# EAGLE design led555 (EAGLE 8.2.2)
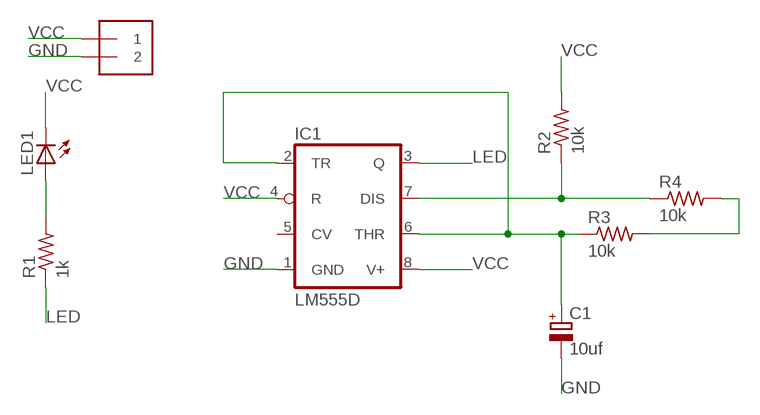
[diagram p0: schematic, sheet 1]

## Parts
C1  10uf  CPOL-EU140CLH-0810  [140CLH-0810]
IC1  LM555D  [SO08]
J1  power  1X2-3.5MM  [1X2-3.5MM]
LED1  LED5MM  [LED5MM]
R1  1k  R-US_M1206  [M1206]
R2  10k  R-US_M1206  [M1206]
R3  10k  R-US_M1206  [M1206]
R4  10k  R-US_M1206  [M1206]

## Nets
GND: C1.- IC1.1(GND) J1.2
LED: IC1.3(Q) R1.1
N$1: LED1.A R1.2
N$2: C1.+ IC1.2(TR) IC1.6(THR) R3.1
N$3: R3.2 R4.2
N$4: IC1.7(DIS) R2.1 R4.1
VCC: IC1.4(R) IC1.8(V+) J1.1 LED1.K(C) R2.2
Unconnected: IC1.5(CV)

## Library data of the parts
C1 = rcl:CPOL-EU: POLARIZED CAPACITOR, European symbol
IC1 = adafruit:*555: TIMER Changed DIP package to have round (not oval) pin pads http://www.ladyada.net/library/pcb/eaglelibrary.html
J1 = adafruit:1X2: 3.5mm Terminal block http://www.ladyada.net/library/pcb/eaglelibrary.html
LED1 = adafruit:LED: LED OSRAM: - CHIPLED LG R971, LG N971, LY N971, LG Q971, LY Q971, LO R971, LY R971 LH N974, LH R974 LS Q976, LO Q976, LY Q976 LO Q996 - Hyper CHIPLED LW Q18S LB Q993, LB Q99A, LB R99A - SideLED LS A670, LO A670, LY A670, LG A670, LP A670 LB A673, LV A673, LT A673, LW A673 LH A674 LY A675 LS A676, LA A676, LO A676, LY A676, LW A676 LS A679, LY A679, LG A679 - Hyper Micro SIDELED® LS Y876, LA Y876, LO Y876, LY Y876 LT Y87S - SmartLED LW L88C, LW L88S LB L89C, LB L89S, LG L890 LS L89K, LO L89K, LY L89K LS L896, LA L896, LO L896, LY L896 - TOPLED LS T670, LO T670, LY T670, LG T670, LP T670 LSG T670, LSP T670, LSY T670, LOP T670, LYG T670 LG T671, LOG T671, LSG T671 LB T673, LV T673, LT T673, LW T673 LH T674 LS T676, LA T676, LO T676, LY T676, LB T676, LH T676, LSB T676, LW T676 LB T67C, LV T67C, LT T67C, LS T67K, LO T67K, LY T67K, LW E67C LS E67B, LA E67B, LO E67B, LY E67B, LB E67C, LV E67C, LT E67C LW T67C LS T679, LY T679, LG T679 LS T770, LO T770, LY T770, LG T770, LP T770 LB T773, LV T773, LT T773, LW T773 LH T774 LS E675, LA E675, LY E675, LS T675 LS T776, LA T776, LO T776, LY T776, LB T776 LHGB T686 LT T68C, LB T68C - Hyper Mini TOPLED® LB M676 - Mini TOPLED Santana® LG M470 LS M47K, LO M47K, LY M47K Source: http://www.osram.convergy.de/
R1-R4 = adafruit:R-US_: RESISTOR, American symbol

## Board
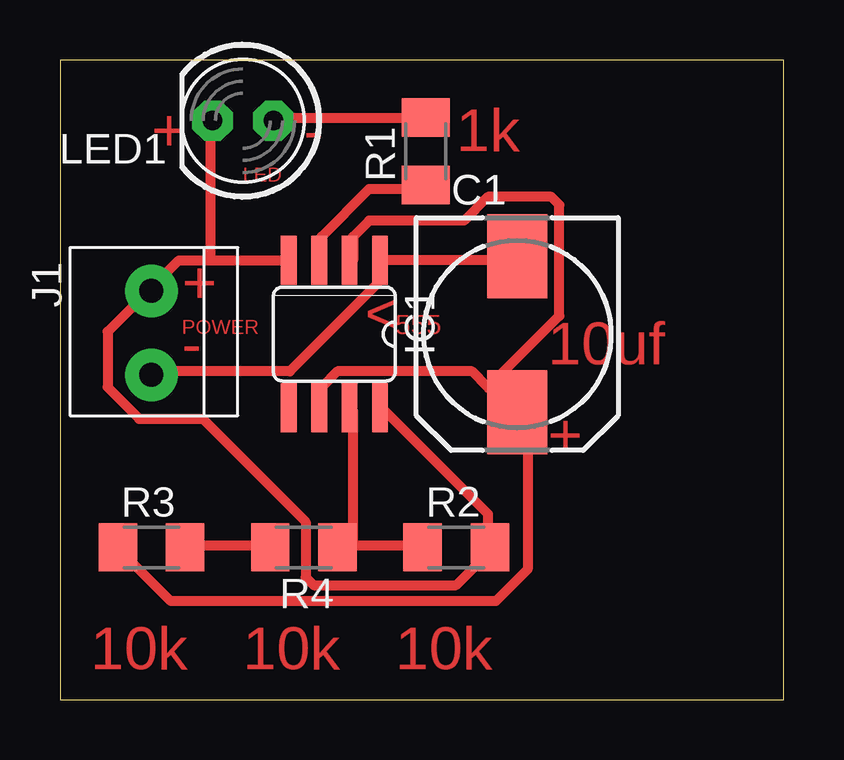
[diagram p1: board, top side]

Size 30.15 x 26.66 mm. Coordinates in mm from the lower left corner, seen from the top.
Outline: 0,0 30.15,0 30.15,26.66 0,26.66 0,0
Copper layers (1*16): Top 0.035mm / dielectric 1.5mm / Bottom 0.035mm
Design rules "default *": minimum track width 16mil, minimum drill 0.35mm, track to track 10mil, track to pad 10mil, pad to pad 10mil, via to via 10mil, smd to smd 16mil, copper to edge 40mil, drill to drill 6mil, minimum pad ring 10mil, minimum via ring 8mil, stop-mask expansion 4mil, vias tented up to drill 0mil, thermal gap 10mil

### Footprints (pad centres in the part's own frame; a part is rotated, then mirrored left to right if it is on the bottom)
140CLH-0810 = smd 3.5 x 2.5: + 3.25,0; - -3.25,0
SO08 = smd 0.66 x 2.032: 1 -1.905,-3.073; 2 -0.635,-3.073; 3 0.635,-3.073; 4 1.905,-3.073; 5 1.905,3.073; 6 0.635,3.073; 7 -0.635,3.073; 8 -1.905,3.073
1X2-3.5MM = drill 1 pad 2.184: 1 1.8,0; 2 -1.7,0
LED5MM = drill 0.813 pad 1.676 octagon: A -1.27,0; K 1.27,0
M1206 = smd 1.6 x 2: 1 -1.4,0; 2 1.4,0

### Placement (x,y rotation side)
C1  19.05,15.24 270 top
IC1  11.43,15.24 180 top
J1  3.81,15.24 90 top
LED1  7.62,24.13 180 top
R1  15.24,22.86 90 top
R2  16.51,6.35 0 top
R3  3.81,6.35 0 top
R4  10.16,6.35 180 top

### Tracks (layer width: path | path; a pad name or v marks a point on that pad's centre or on a via)
GND
  Top 0.406: C1.- 18.82,18.31 IC1.1 13.21,18.31 13.21,17.32 9.58,13.69 3.96,13.69 J1.2
LED
  Top 0.406: R1.1 15.19,21.28 12.88,21.28 10.9,19.3 10.9,18.31 IC1.3
N$1
  Top 0.406: R1.2 15.19,24.26 8.91,24.26 LED1.A
N$2
  Top 0.406: R3.1 2.64,6.1 4.62,4.11 18.16,4.11 19.48,5.44 19.48,11.38 19.15,11.71 C1.+ | 17.83,13.03 18.82,12.04 C1.+ | 17.83,13.03 17.17,13.69 11.56,13.69 10.9,13.03 10.9,12.37 IC1.6 | 17.83,13.03 20.8,16 20.8,20.62 20.47,20.95 17.83,20.95 16.84,19.96 12.88,19.96 12.22,19.3 12.22,18.31 IC1.2 | 17.83,13.03 C1.+
N$3
  Top 0.406: R3.2 5.28,6.43 8.59,6.43 R4.2
N$4
  Top 0.406: 12.22,6.43 14.86,6.43 R2.1 | 12.22,6.43 11.89,6.43 R4.1 12.22,6.43 | 12.22,6.43 12.22,12.04 IC1.7
VCC
  Top 0.406: IC1.8 13.54,12.04 17.83,7.75 17.83,6.43 R2.2 17.83,6.1 16.51,4.77 10.57,4.77 10.24,5.1 10.24,7.42 5.94,11.71 3.3,11.71 1.98,13.03 1.98,15.34 3.63,16.99 J1.1 3.96,17.32 4.95,18.31 6.27,18.31 | 6.27,18.31 IC1.4 | 6.27,18.31 6.27,23.93 LED1.K

### Text on the board
Top: + | - | 1k | LED | + | POWER | < | 555 | - | 10uf | + | 10k | 10k | 10k